# Altium schematic sheet CAN_Controller.SchDoc
size 279 x 215 mm; SheetNumber: 4; SheetTotal: 4
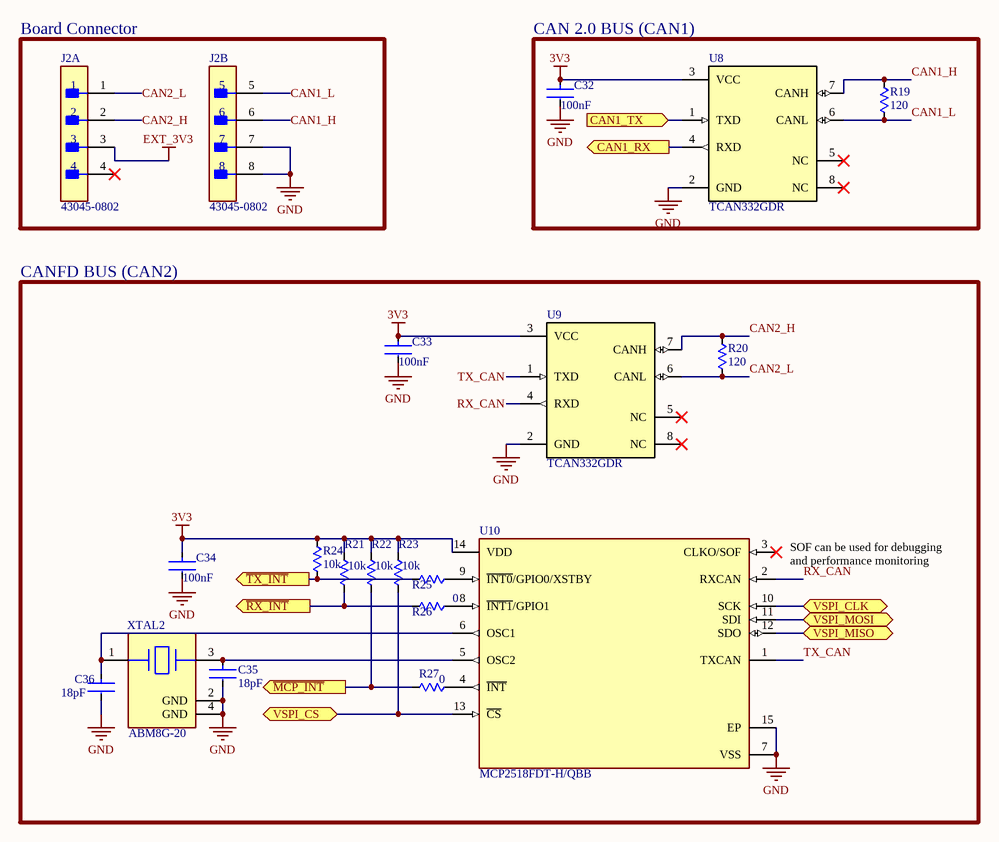
[diagram p0: CAN_Controller.SchDoc]

## Parts
C32  value 100nF  [FP-CL10-IPC_B]  (hidden comment: CL10B104KB8WPNC)
C33  value 100nF  [FP-CL10-IPC_B]  (hidden comment: CL10B104KB8WPNC)
C34  value 100nF  [FP-CL10-IPC_B]  (hidden comment: CL10B104KB8WPNC)
C35  value 18pF  [FP-C0402-BB-MFG]  (hidden comment: C0402C180J3GACAUTO)
C36  value 18pF  [FP-C0402-BB-MFG]  (hidden comment: C0402C180J3GACAUTO)
J2  43045-0802  [FP-43045-0802-MFG]  (parts A,B of 2)
R19  value 120  [FP-CRCW0603-e3-IPC_B]  (hidden comment: CRCW0603120RFKTA)
R20  value 120  [FP-CRCW0603-e3-IPC_B]  (hidden comment: CRCW0603120RFKTA)
R21  value 10k  [FP-CRCW0603-e3-IPC_B]  (hidden comment: CRCW060310K0FKEA)
R22  value 10k  [FP-CRCW0603-e3-IPC_B]  (hidden comment: CRCW060310K0FKEA)
R23  value 10k  [FP-CRCW0603-e3-IPC_B]  (hidden comment: CRCW060310K0FKEA)
R24  value 10k  [FP-CRCW0603-e3-IPC_B]  (hidden comment: CRCW060310K0FKEA)
R25  CRCW06030000Z0EA  [FP-CRCW0603-e3-IPC_B]  (value not drawn)
R26  value 0  [FP-CRCW0603-e3-IPC_B]  (hidden comment: CRCW06030000Z0EA)
R27  value 0  [FP-CRCW0603-e3-IPC_B]  (hidden comment: CRCW06030000Z0EA)
U8  TCAN332GDR  [TCAN332GDR-Footprint-1]
U9  TCAN332GDR  [TCAN332GDR-Footprint-1]
U10  MCP2518FDT-H/QBB  [FP-C04-21361-IPC_A]
XTAL2  ABM8G-20  [FP-ABM8G-MFG]

## Blocks framed on the sheet
Board Connector: J2
CAN 2.0 BUS (CAN1): C32 R19 U8
CANFD BUS (CAN2): C33-C36 R20-R27 U9 U10 XTAL2

## Ports
CAN1_RX (out, see Telemetry_Module[4B], ESP32[5B]), CAN1_TX (in, see Telemetry_Module[4B], ESP32[5B]), VSPI_CLK (bidir, see Telemetry_Module[4C], ESP32[5B]), VSPI_CS (bidir, see Telemetry_Module[4C], ESP32[5B]), VSPI_MISO (bidir, see Telemetry_Module[4B], ESP32[5B]), VSPI_MOSI (bidir, see Telemetry_Module[4B], ESP32[5B]), ~{MCP_INT} (out, see Telemetry_Module[4C], ESP32[5C]), ~{RX_INT} (out, see Telemetry_Module[4C], ESP32[5C]), ~{TX_INT} (out, see Telemetry_Module[4C], ESP32[5C])

## Nets
3V3: C32.1 C33.1 C34.1 R21.2 R22.2 R23.2 R24.2 U8.3(VCC) U9.3(VCC) U10.14(VDD)
EXT_3V3: J2.3
GND: C32.2 C33.2 C34.2 C35.2 C36.2 J2.7 J2.8 U8.2(GND) U9.2(GND) U10.7(VSS) U10.15(EP) XTAL2.2(GND) XTAL2.4(GND)
~{MCP_INT}: R22.1 R27.1 ; port ~{MCP_INT}
~{RX_INT}: R21.1 R26.1 ; port ~{RX_INT}
~{TX_INT}: R24.1 R25.1 ; port ~{TX_INT}
CAN1_H: J2.6 R19.2 U8.7(CANH)
CAN1_L: J2.5 R19.1 U8.6(CANL)
CAN1_RX: U8.4(RXD) ; port CAN1_RX
CAN1_TX: U8.1(TXD) ; port CAN1_TX
CAN2_H: J2.2 R20.2 U9.7(CANH)
CAN2_L: J2.1 R20.1 U9.6(CANL)
RX_CAN: U9.4(RXD) U10.2(RXCAN)
TX_CAN: U9.1(TXD) U10.1(TXCAN)
VSPI_CLK: U10.10(SCK) ; port VSPI_CLK
VSPI_CS: R23.1 U10.13(~{CS}) ; port VSPI_CS
VSPI_MISO: U10.12(SDO) ; port VSPI_MISO
VSPI_MOSI: U10.11(SDI) ; port VSPI_MOSI
NetC35_1: C35.1 U10.5(OSC2) XTAL2.3
NetC36_1: C36.1 U10.6(OSC1) XTAL2.1
NetR25_2: R25.2 U10.9(~{INT0}/GPIO0/XSTBY)
NetR26_2: R26.2 U10.8(~{INT1}/GPIO1)
NetR27_2: R27.2 U10.4(~{INT})

Not connected (* = marked no-connect by the designer): J2 4*; U8 5(NC)* 8(NC)*; U9 5(NC)* 8(NC)*; U10 3(CLKO/SOF)*

## Notes on the sheet
- (near U10) SOF can be used for debugging and performance monitoring
- Title
- Date
- Sheet
- of
- File
- Author

## Library data of the parts
C32-C34 = CMP-001-00005-5: 0.1 µF ±10% 50V Ceramic Capacitor X7R 0603 (1608 Metric); Case/Package: 0603; Min Operating Temperature: -55°C; Mounting Technology: Surface Mount; Pins: 2; Max Operating Temperature: 125°C; Capacitor Type: Ceramic; Voltage Rating: 50V
C35 C36 = CMP-001-00084-1: Ceramic Capacitor, Multilayer, Ceramic, 25V, 5% +Tol, 5% -Tol, C0G, 30ppm/Cel TC, 0.000018uF, Surface Mount, 0402; Case/Package: 0402; Min Operating Temperature: -55°C; Capacitor Type: Ceramic; Pins: 2; Mounting Technology: Surface Mount; RoHS Compliant: Yes; Max Operating Temperature: 125°C
J2 = CMP-002-00068-1: CONN HEADER R/A 8POS 3MM; Connector Type: Power,Rectangular; RoHS Compliant: Yes; Mounting Technology: Board; Min Operating Temperature: -40°C; Pins: 8; Max Operating Temperature: 105°C
R19 R20 = CMP-009-00163-1: 120 Ohms ±1% 0.1W, 1/10W Chip Resistor 0603 (1608 Metric) Automotive AEC-Q200 Thick Film; Power: 100mW; RoHS Compliant: No; Case/Package: 0603; Min Operating Temperature: -55°C; Mounting Technology: Surface Mount; Max Operating Temperature: 155°C; Pins: 2; Tolerance: 1%
R21-R24 = CMP-009-00002-2: 10 kOhms ±1% 0.1W, 1/10W Chip Resistor 0603 (1608 Metric) Automotive AEC-Q200 Thick Film; Voltage Rating: 75V; Power: 100mW; Mounting Technology: Surface Mount; Max Operating Temperature: 155°C; Pins: 2; Min Operating Temperature: -55°C; Tolerance: 1%; Case/Package: 0603
R25-R27 = CMP-009-00025-3: 0 Ohms Jumper Chip Resistor 0603 (1608 Metric) Automotive AEC-Q200 Thick Film; Voltage Rating: 75V; Case/Package: 0603; Min Operating Temperature: -55°C; Max Operating Temperature: 155°C
U8 U9 = CMP-015-00000-4: 3.3-V CAN Transceiver with CAN FD; Nominal Supply Voltage: 3.3V; Pins: 8; Min Operating Temperature: -40°C; RoHS Compliant: Yes; Case/Package: SOIC; Max Operating Temperature: 125°C
U10 = CMP-015-00008-1: 1 Channel(s), 8MBps, CMOS, PDCC14; RoHS Compliant: Yes
XTAL2 = CMP-003-00003-1: Crystal 20MHz ±20ppm (Tol) ±30ppm (Stability) 18pF FUND 80Ohm 4-Pin Ultra Mini-CSMD T/R